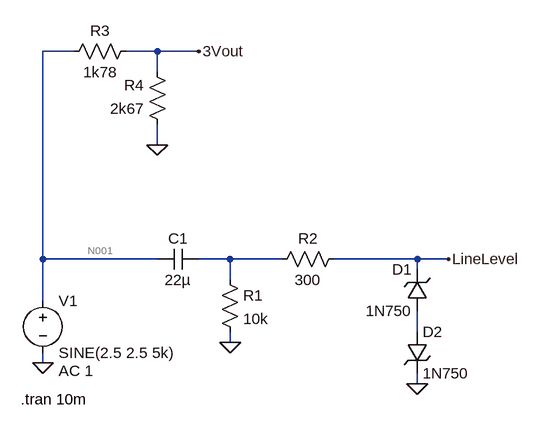
[diagram p0: schematic Audio_Output.asc]
Audio_Output.asc, the LTspice schematic file:
Version 4
SHEET 1 880 680
WIRE 80 -272 32 -272
WIRE 208 -272 160 -272
WIRE 272 -272 208 -272
WIRE 208 -240 208 -272
WIRE 208 -128 208 -160
WIRE 32 48 32 -272
WIRE 208 48 32 48
WIRE 320 48 272 48
WIRE 400 48 320 48
WIRE 608 48 480 48
WIRE 656 48 608 48
WIRE 608 64 608 48
WIRE 320 80 320 48
WIRE 32 112 32 48
WIRE 608 160 608 128
WIRE 320 176 320 160
WIRE 32 208 32 192
WIRE 608 240 608 224
FLAG 32 208 0
FLAG 320 176 0
FLAG 608 240 0
FLAG 656 48 LineLevel
FLAG 272 -272 3Vout
FLAG 208 -128 0
SYMBOL voltage 32 96 R0
WINDOW 123 24 124 Left 2
WINDOW 39 0 0 Left 0
SYMATTR InstName V1
SYMATTR Value SINE(2.5 2.5 5k)
SYMATTR Value2 AC 1
SYMBOL cap 272 32 R90
WINDOW 0 0 32 VBottom 2
WINDOW 3 32 32 VTop 2
SYMATTR InstName C1
SYMATTR Value 22µ
SYMBOL res 304 64 R0
SYMATTR InstName R1
SYMATTR Value 10k
SYMBOL zener 624 128 R180
WINDOW 0 24 64 Left 2
WINDOW 3 24 0 Left 2
SYMATTR InstName D1
SYMATTR Value 1N750
SYMBOL zener 592 160 R0
SYMATTR InstName D2
SYMATTR Value 1N750
SYMBOL res 496 32 R90
WINDOW 0 0 56 VBottom 2
WINDOW 3 32 56 VTop 2
SYMATTR InstName R2
SYMATTR Value 300
SYMBOL res 176 -288 R90
WINDOW 0 0 56 VBottom 2
WINDOW 3 32 56 VTop 2
SYMATTR InstName R3
SYMATTR Value 1k78
SYMBOL res 224 -144 R180
WINDOW 0 36 76 Left 2
WINDOW 3 36 40 Left 2
SYMATTR InstName R4
SYMATTR Value 2k67
TEXT -2 264 Left 2 !.tran 10m

The netlist it stands for:
* Audio_Output.asc
V1 N001 0 SINE(2.5 2.5 5k) AC 1
C1 N002 N001 22µ
R1 N002 0 10k
D1 N003 LineLevel 1N750
D2 N003 0 1N750
R2 LineLevel N002 300
R3 3Vout N001 1k78
R4 0 3Vout 2k67
.model D D
.lib standard.dio
.tran 10m
.backanno
.end

* Results of the author's LTspice run, read from the files saved beside the schematic
* Operating Point, zero values left out:
*   V(n001) = 2.5 V
*   V(3vout) = 1.5 V
*   I(R3) = -561.8 µA
*   I(R4) = -561.8 µA
*   I(V1) = -561.8 µA